# Altium schematic sheet Battery_Protection.SchDoc
size A4; SheetNumber: 11; SheetTotal: 13
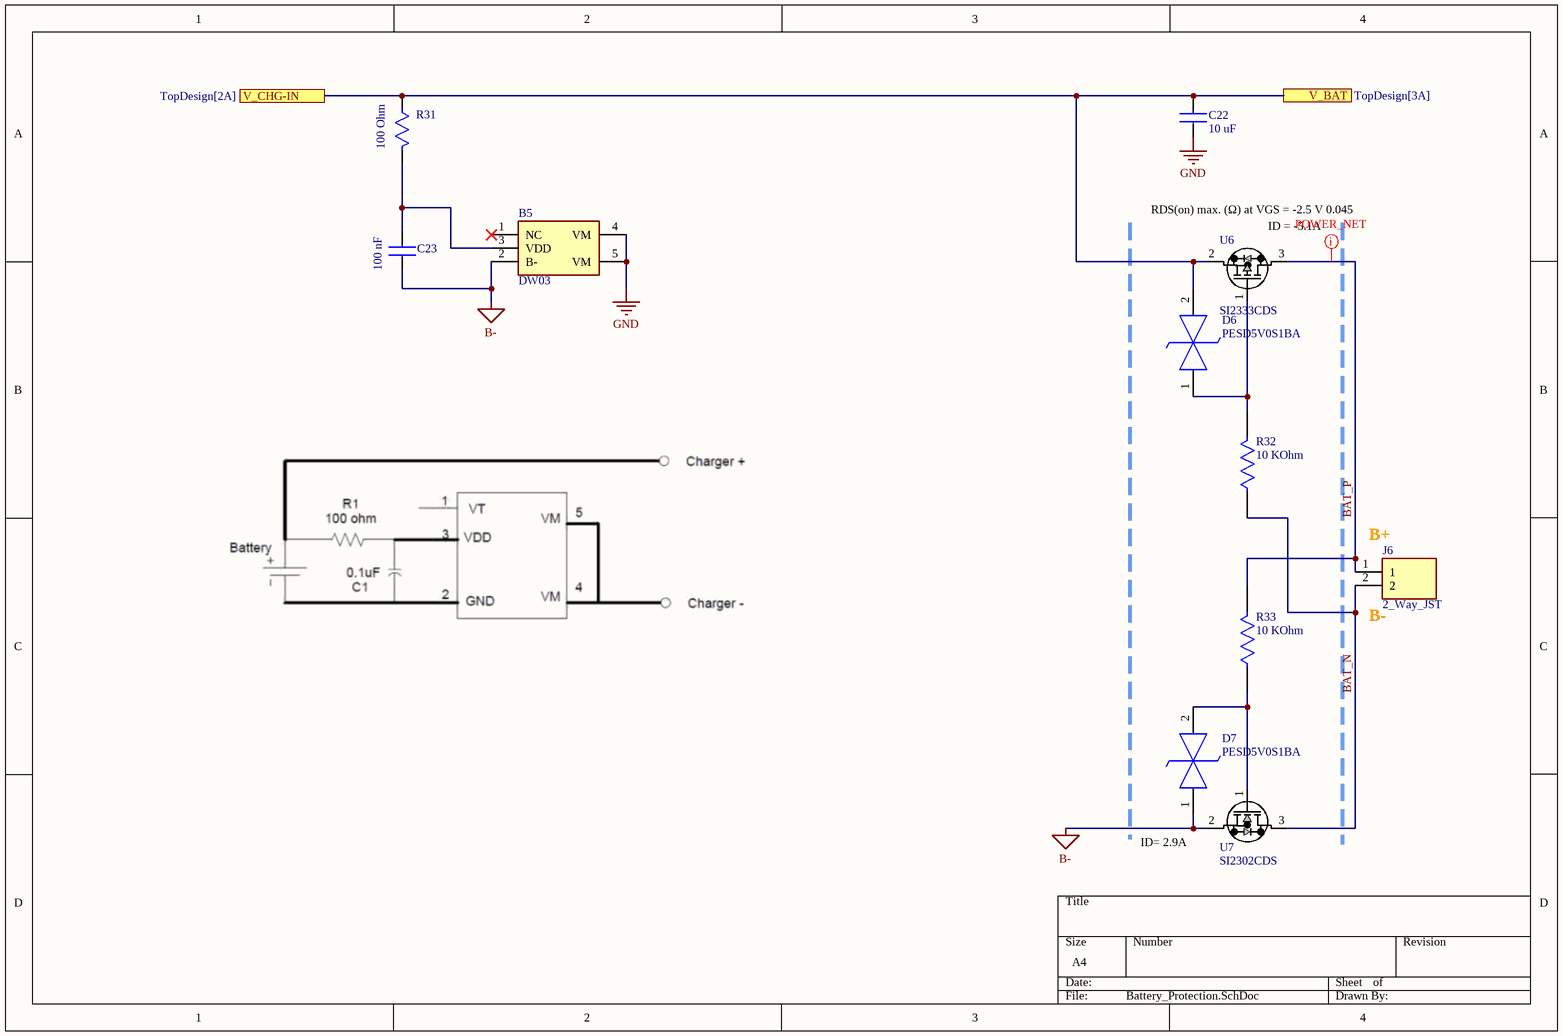
[diagram p0: Battery_Protection.SchDoc]

## Parts
B5  DW03  [DW03]
C22  10 uF  [CAP_0603]
C23  100 nF  [CAP_0603]
D6  PESD5V0S1BA  [TVS_SOD-323]
D7  PESD5V0S1BA  [TVS_SOD-323]
J6  2_Way_JST  [2_Way_JST_Connector]
R31  100 Ohm  [Res_0603]
R32  10 KOhm  [Res_0603]
R33  10 KOhm  [Res_0603]
U6  SI2333CDS  [SOT-23]
U7  SI2302CDS  [SOT-23]

## Ports
V_BAT (see TopDesign[3A]), V_CHG-IN (see TopDesign[2A])

## Nets
B-: B5.2(B-) C23.1 D7.1(K1) U7.2(S)
GND: B5.4(VM) B5.5(VM) C22.1
BAT_N: J6.2 R32.1 U7.3(D)
BAT_P: J6.1 R33.2 U6.3(D)
V_BAT: C22.2 D6.2(K2) R31.2 U6.2(S) ; port V_BAT, port V_CHG-IN
NetB5_3: B5.3(VDD) C23.2 R31.1
NetD6_1: D6.1(K1) R32.2 U6.1(G)
NetD7_2: D7.2(K2) R33.1 U7.1(G)

Not connected (* = marked no-connect by the designer): B5 1(NC)*

## Layout directives
mark named POWER_NET: BAT_P

## Notes on the sheet
- (near U6) RDS(on) max. (Ω) at VGS = -2.5 V 0.045
- (near U6) ID = -5.1A
- (near J6) B+
- (near J6) B-
- (near U7) ID= 2.9A

## Library data of the parts
B5 = DW03: 2K 256X8 1.8V Ser.EEPROM,24AA02E48T-I/OT; Manufacturer_Name: HXY MOSFET; Geometry.Height: 1.45mm; Manufacturer_Part_Number: DW03; Datasheet Link: https://www.lcsc.com/datasheet/C18198382.pdf; LCSC: C18198382
C22 C23 = Cap_SMD_New: Cap Ceramic 1uF 10V X5R 10% Pad SMD 0402 85C T/R; Manufacturer_Name: SAMSUNG; Manufacturer_Part_Number: CL05A105KP5NNNC; Geometry.Height: 0.55mm; Mouser Part Number: 187-CL05A105KP5NNNC; Mouser Price/Stock: https://www.mouser.co.uk/ProductDetail/Samsung-Electro-Mechanics/CL05A105KP5NNNC?qs=X6jEic%2FHinBsUeNeR9HD7w%3D%3D; Arrow Part Number: CL05A105KP5NNNC; Arrow Price/Stock: https://www.arrow.com/en/products/cl05a105kp5nnnc/samsung-electro-mechanics?region=nac; Datasheet Link: https://www.arrow.com/en/products/cl05a105kp5nnnc/samsung-electro-mechanics
D6 D7 = TVS_Diode_Bi-Direcctional: Diode ESD (Bi-directional); Manufacturer_Name: Nexperia; Manufacturer_Part_Number: PESD12VL1BA,115; Datasheet Link: https://assets.nexperia.com/documents/data-sheet/PESDXL1BA_SER.pdf; Height: 1.1mm; Mouser Part Number: 771-PESD12VL1BA-T/R; Mouser Price/Stock: https://www.mouser.co.uk/ProductDetail/Nexperia/PESD12VL1BA115?qs=LOCUfHb8d9tizc9iojOZUw%3D%3D; Arrow Part Number: PESD12VL1BA,115; Arrow Price/Stock: https://www.arrow.com/en/products/pesd12vl1ba115/nexperia?region=europe
J6 = 2_Way_JST_Connector: Connector Header Through Hole 2 position 0.098 (2.50mm); MF: JST Sales; MP: B2B-XH-A(LF)(SN); Value: *; Check_prices: https://www.snapeda.com/parts/B2B-XH-A(LF)(SN)/JST%20Sales%20America%20Inc./view-part/492310/?ref=eda; Price: None; Package: None; Availability: In Stock; SnapEDA_Link: https://www.snapeda.com/parts/B2B-XH-A(LF)(SN)/JST%20Sales%20America%20Inc./view-part/492310/?ref=snap
R31-R33 = Res smd: SMD Resistor; MP: RC0805FR-07330RL; MF: Yageo; Package: 2012 Rohm Semiconductor; Value: *; SnapEDA_Link: https://www.snapeda.com/parts/RC0805FR-07330RL/Yageo/view-part/106115/?ref=snap; Price: None; Availability: Unavailable
U6 = SI2333CDS: P-Channel  MOSFET Vds=12V ,RDS(on)=35mOhm .  at VGS = 4.5 V; Mfr_Name: Vishay; Type: P-MOSFET; LCSC: C48179
U7 = SI2302CDS: N-Channel  MOSFET Vds=20V ,RDS(on)=57mOhm .  at VGS = 4.5 V; Mfr_Name: Vishay; Type: N-MOSFET; LCSC: C10488